# Altium schematic sheet MD017A ISO-F28027F_1.SchDoc: LAUNCHXL-F28027 NewVersion
size 301 x 237 mm; Date: 7/10/2018 10:05:19 AM; SheetNumber: 2
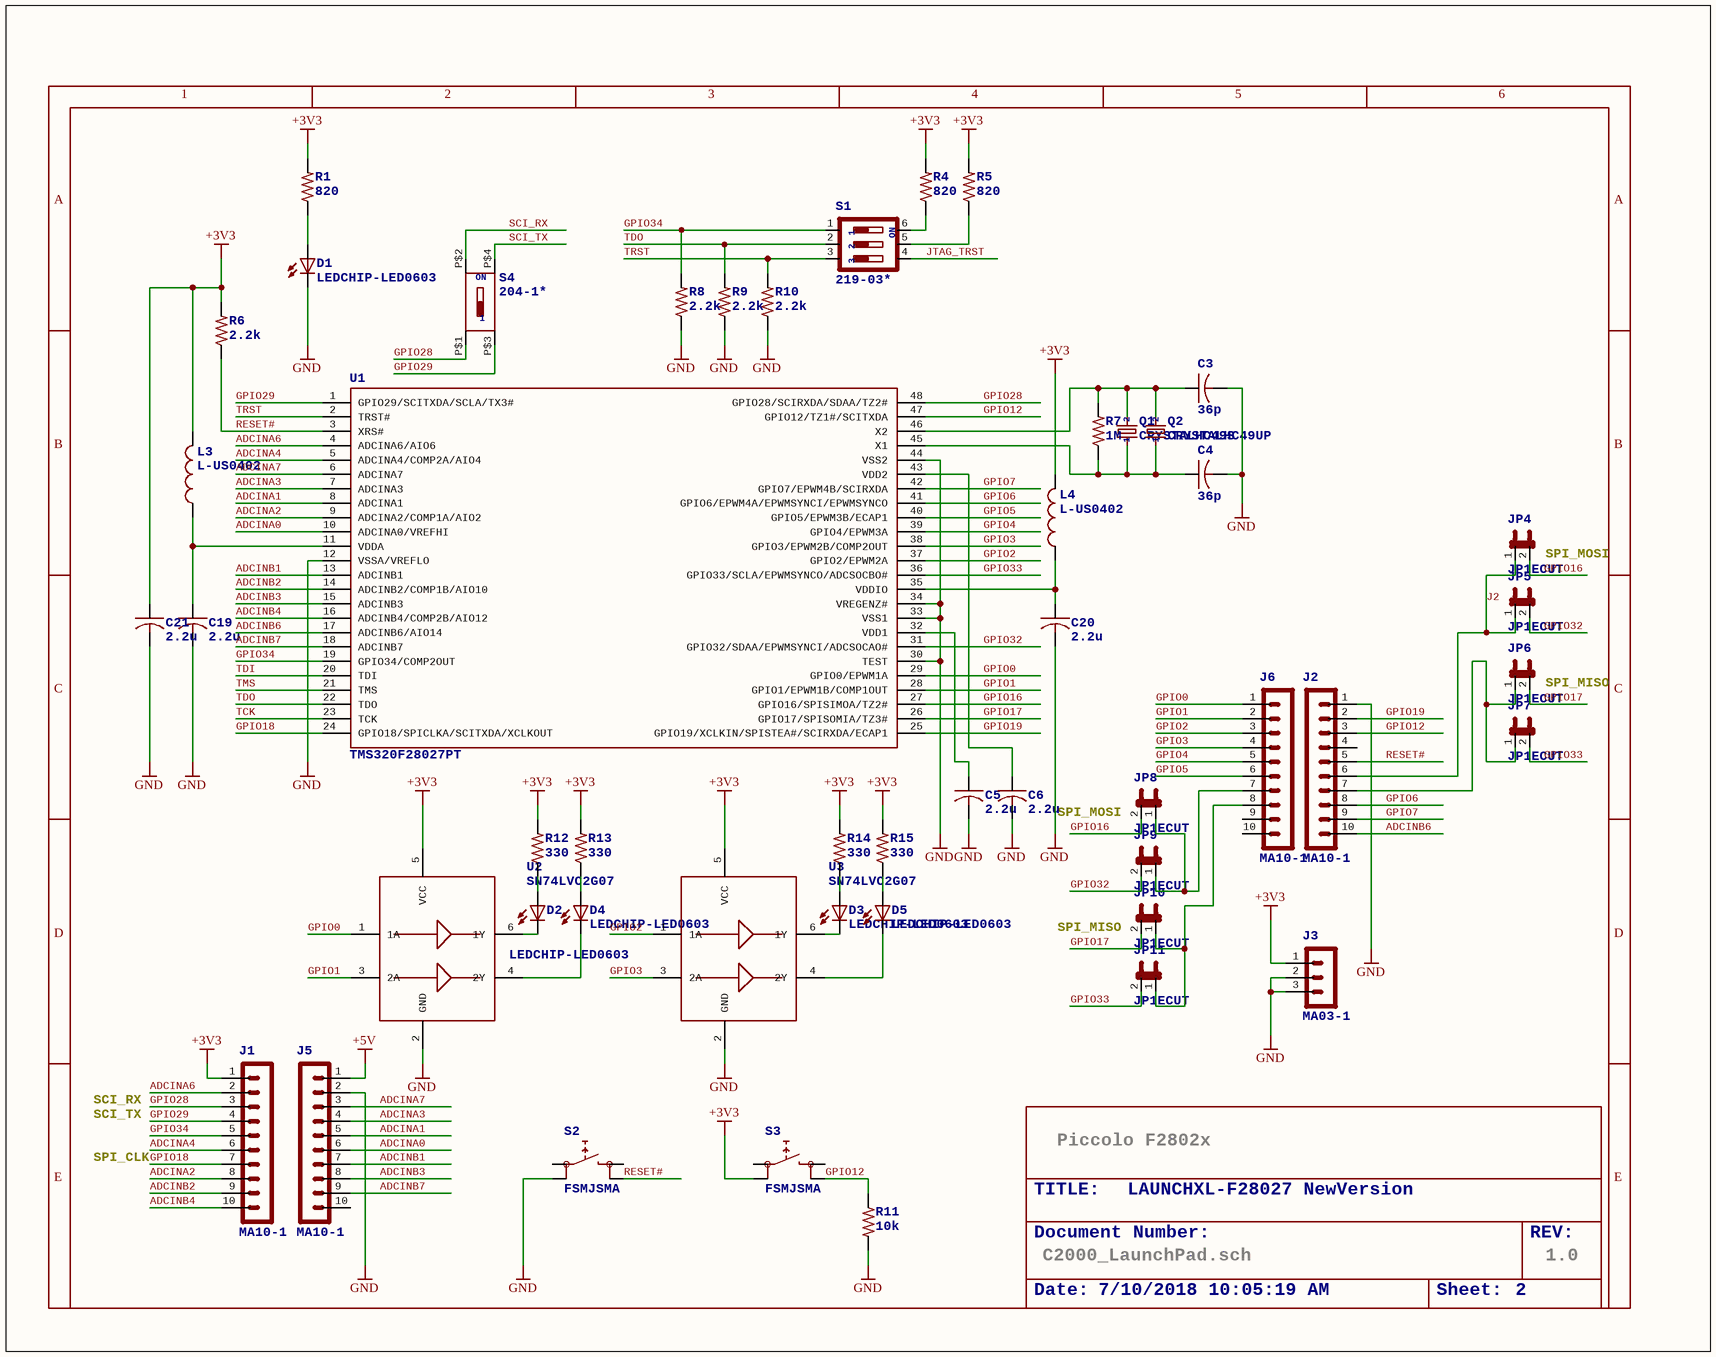
[diagram p0: MD017A ISO-F28027F_1.SchDoc]

## Parts
C3  36p  [C0402]
C4  36p  [C0402]
C5  2.2u  [C0402]
C6  2.2u  [C0402]
C19  2.2u  [C0402]
C20  2.2u  [C0402]
C21  2.2u  [C0402]
D1  LEDCHIP-LED0603  [CHIP-LED0603]
D2  LEDCHIP-LED0603  [CHIP-LED0603]
D3  LEDCHIP-LED0603  [CHIP-LED0603]
D4  LEDCHIP-LED0603  [CHIP-LED0603]
D5  LEDCHIP-LED0603  [CHIP-LED0603]
J1  MA10-1  [MA10-1]
J2  MA10-1  [MA10-1]
J3  MA03-1  [MA03-1]
J5  MA10-1  [MA10-1]
J6  MA10-1  [MA10-1]
JP4  JP1ECUT  [C0402]
JP5  JP1ECUT  [C0402]
JP6  JP1ECUT  [C0402]
JP7  JP1ECUT  [C0402]
JP8  JP1ECUT  [C0402]
JP9  JP1ECUT  [C0402]
JP10  JP1ECUT  [C0402]
JP11  JP1ECUT  [C0402]
L3  L-US0402  [R0402]
L4  L-US0402  [R0402]
Q1  CRYSTALHC49S  [HC49/S]
Q2  CRYSTALHC49UP  [HC49UP]
R1  820  [R0402]
R4  820  [R0402]
R5  820  [R0402]
R6  2.2k  [R0402]
R7  1M  [R0402]
R8  2.2k  [R0402]
R9  2.2k  [R0402]
R10  2.2k  [R0402]
R11  10k  [R0402]
R12  330  [R0402]
R13  330  [R0402]
R14  330  [R0402]
R15  330  [R0402]
S1  219-03*  [CTS-219-03]
S2  FSMJSMA  [FSMJSMA]
S3  FSMJSMA  [FSMJSMA]
S4  204-1*  [CTS-204-1]
U1  TMS320F28027PT  [PQFP48]
U2  SN74LVC2G07  [SOT23-6-DBV]
U3  SN74LVC2G07  [SOT23-6-DBV]

## Nets
+3V3: C21.1 J1.1 J3.1 L3.2 L4.2 R1.2 R4.2 R5.2 R6.2 R12.2 R13.2 R14.2 R15.2 S3.P$2 U2.5(VCC) U3.5(VCC)
+5V: J5.1
GND: C3.2 C4.2 C5.2 C6.2 C19.2 C20.2 C21.2 D1.C J2.1 J3.2 J3.3 J5.2 R8.1 R9.1 R10.1 R11.2 S2.P$2 U1.12(VSSA/VREFLO) U1.30(TEST) U1.33(VSS1) U1.34(VREGENZ#) U1.44(VSS2) U2.2(GND) U3.2(GND)
ADCINA0: J5.6 U1.10(ADCINA0/VREFHI)
ADCINA1: J5.5 U1.8(ADCINA1)
ADCINA2: J1.8 U1.9(ADCINA2/COMP1A/AIO2)
ADCINA3: J5.4 U1.7(ADCINA3)
ADCINA4: J1.6 U1.5(ADCINA4/COMP2A/AIO4)
ADCINA6: J1.2 U1.4(ADCINA6/AIO6)
ADCINA7: J5.3 U1.6(ADCINA7)
ADCINB1: J5.7 U1.13(ADCINB1)
ADCINB2: J1.9 U1.14(ADCINB2/COMP1B/AIO10)
ADCINB3: J5.8 U1.15(ADCINB3)
ADCINB4: J1.10 U1.16(ADCINB4/COMP2B/AIO12)
ADCINB6: J2.10 U1.17(ADCINB6/AIO14)
ADCINB7: J5.9 U1.18(ADCINB7)
GPIO0: J6.1 U1.29(GPIO0/EPWM1A) U2.1(1A)
GPIO1: J6.2 U1.28(GPIO1/EPWM1B/COMP1OUT) U2.3(2A)
GPIO2: J6.3 U1.37(GPIO2/EPWM2A) U3.1(1A)
GPIO3: J6.4 U1.38(GPIO3/EPWM2B/COMP2OUT) U3.3(2A)
GPIO4: J6.5 U1.39(GPIO4/EPWM3A)
GPIO5: J6.6 U1.40(GPIO5/EPWM3B/ECAP1)
GPIO6: J2.8 U1.41(GPIO6/EPWM4A/EPWMSYNCI/EPWMSYNCO)
GPIO7: J2.9 U1.42(GPIO7/EPWM4B/SCIRXDA)
GPIO12: J2.3 R11.1 S3.P$4 U1.47(GPIO12/TZ1#/SCITXDA)
GPIO16: JP4.2 JP8.2 U1.27(GPIO16/SPISIMOA/TZ2#)
GPIO17: JP6.2 JP10.2 U1.26(GPIO17/SPISOMIA/TZ3#)
GPIO18: J1.7 U1.24(GPIO18/SPICLKA/SCITXDA/XCLKOUT)
GPIO19: J2.2 U1.25(GPIO19/XCLKIN/SPISTEA#/SCIRXDA/ECAP1)
GPIO28: J1.3 S4.P$1 U1.48(GPIO28/SCIRXDA/SDAA/TZ2#)
GPIO29: J1.4 S4.P$3 U1.1(GPIO29/SCITXDA/SCLA/TX3#)
GPIO32: JP5.2 JP9.2 U1.31(GPIO32/SDAA/EPWMSYNCI/ADCSOCAO#)
GPIO33: JP7.2 JP11.2 U1.36(GPIO33/SCLA/EPWMSYNCO/ADCSOCBO#)
GPIO34: J1.5 R8.2 S1.1 U1.19(GPIO34/COMP2OUT)
J2: J2.6 JP4.1 JP5.1
JTAG_TRST: S1.4
RESET#: J2.5 R6.1 S2.P$4 U1.3(XRS#)
SCI_RX: S4.P$2
SCI_TX: S4.P$4
TCK: U1.23(TCK)
TDI: U1.20(TDI)
TDO: R9.2 S1.2 U1.22(TDO)
TMS: U1.21(TMS)
TRST: R10.2 S1.3 U1.2(TRST#)
NetC3_1: C3.1 Q1.2 Q2.2 R7.2 U1.46(X2)
NetC4_1: C4.1 Q1.1 Q2.1 R7.1 U1.45(X1)
NetC5_1: C5.1 U1.32(VDD1)
NetC6_1: C6.1 U1.43(VDD2)
NetC19_1: C19.1 L3.1 U1.11(VDDA)
NetC20_1: C20.1 L4.1 U1.35(VDDIO)
NetD1_A: D1.A R1.1
NetD2_A: D2.A R12.1
NetD2_C: D2.C U2.6(1Y)
NetD3_A: D3.A R14.1
NetD3_C: D3.C U3.6(1Y)
NetD4_A: D4.A R13.1
NetD4_C: D4.C U2.4(2Y)
NetD5_A: D5.A R15.1
NetD5_C: D5.C U3.4(2Y)
NetJ2_7: J2.7 JP6.1 JP7.1
NetJ6_7: J6.7 JP8.1 JP9.1
NetJ6_8: J6.8 JP10.1 JP11.1
NetR4_1: R4.1 S1.6
NetR5_1: R5.1 S1.5

Not connected (* = marked no-connect by the designer): J2 4; J5 10; J6 9 10; S2 P$1(0) P$3(1); S3 P$1(0) P$3(1)

## Notes on the sheet
- (near JP4) SPI_MOSI
- (near JP6) SPI_MISO
- SPI_MOSI
- SPI_MISO
- SCI_RX
- SCI_TX
- SPI_CLK
- Piccolo F2802x
- TITLE:
- Document Number:
- LAUNCHXL-F28027 NewVersion
- REV:
- Date:
- C2000_LaunchPad.sch
- 7/10/2018 10:05:19 AM
- Sheet:
- 2
- 1.0
- 1
- 3
- 4
- 5
- 6
- A
- B
- C
- D
- E

## Library data of the parts
C3-C6 C19-C21 = C-USC0402: CAPACITOR, American symbol
D1-D5 = LEDCHIP-LED0603: LED   OSRAM: - CHIPLED LG R971, LG N971, LY N971, LG Q971, LY Q971, LO R971, LY R971 LH N974, LH R974 LS Q976, LO Q976, LY Q976 LO Q996 - Hyper CHIPLED LW Q18S LB Q993, LB Q99A, LB R99A - SideLED LS A670, LO A670, LY A670, LG A670, LP A670 LB A673, LV A673, LT A673, LW A673 LH A674 LY A675 LS A676, LA A676, LO A676, LY A676, LW A676 LS A679, LY A679, LG A679 -  Hyper Micro SIDELED® LS Y876, LA Y876, LO Y876, LY Y876 LT Y87S - SmartLED LW L88C, LW L88S LB L89C, LB L89S, LG L890 LS L89K, LO L89K, LY L89K LS L896, LA L896, LO L896, LY L896 - TOPLED LS T670, LO T670, LY T670, LG T670, LP T670 LSG T670, LSP T670, LSY T670, LOP T670, LYG T670 LG T671, LOG T671, LSG T671 LB T673, LV T673, LT T673, LW T673 LH T674 LS T676, LA T676, LO T676, LY T676, LB T676, LH T676, LSB T676, LW T676 LB T67C, LV T67C, LT T67C, LS T67K, LO T67K, LY T67K, LW E67C LS E67B, LA E67B, LO E67B, LY E67B, LB E67C, LV E67C, LT E67C LW T67C LS T679, LY T679, LG T679 LS T770, LO T770, LY T770, LG T770, LP T770 LB T773, LV T773, LT T773, LW T773 LH T774 LS E675, LA E675, LY E675, LS T675 LS T776, LA T776, LO T776, LY T776, LB T776 LHGB T686 LT T68C, LB T68C - Hyper Mini TOPLED® LB M676 - Mini TOPLED Santana® LG M470 LS M47K, LO M47K, LY M47K    Source: http://www.osram.convergy.de   LUXEON: - LUMILED® LXK2-PW12-R00, LXK2-PW12-S00, LXK2-PW14-U00, LXK2-PW14-V00 LXK2-PM12-R00, LXK2-PM12-S00, LXK2-PM14-U00 LXK2-PE12-Q00, LXK2-PE12-R00, LXK2-PE12-S00, LXK2-PE14-T00, LXK2-PE14-U00 LXK2-PB12-K00, LXK2-PB12-L00, LXK2-PB12-M00, LXK2-PB14-N00, LXK2-PB14-P00, LXK2-PB14-Q00 LXK2-PR12-L00, LXK2-PR12-M00, LXK2-PR14-Q00, LXK2-PR14-R00 LXK2-PD12-Q00, LXK2-PD12-R00, LXK2-PD12-S00 LXK2-PH12-R00, LXK2-PH12-S00 LXK2-PL12-P00, LXK2-PL12-Q00, LXK2-PL12-R00    Source: www.luxeon.com   KINGBRIGHT:   KA-3528ASYC Source: www.kingbright.com
J1 J2 J5 J6 = MA10-1: PIN HEADER; OC_FARNELL: unknown; OC_NEWARK: unknown
J3 = MA03-1: PIN HEADER; OC_FARNELL: unknown; OC_NEWARK: unknown
JP4-JP11 = JP1ECUT: JUMPER
L3 L4 = L-US0402: INDUCTOR, American symbol
Q1 = CRYSTALHC49S: CRYSTAL; OC_FARNELL: 1667008; OC_NEWARK: unknown; 1: 1; 2: 2
Q2 = CRYSTALHC49UP: CRYSTAL; OC_FARNELL: unknown; OC_NEWARK: unknown; 1: 1; 2: 2
R1 R4-R15 = R-US_R0402: RESISTOR, American symbol
S1 = 219-03*: Surface Mount DIP Switch Series 219 SMT   CTS Electronic Components Sourc: www.ctscorp.com; OC_FARNELL: unknown; OC_NEWARK: unknown; 1: 1; 2: 2; 3: 3; ON: ON
S4 = 204-1*: 1: 1; ON: ON